# EAGLE schematic slave-board (EAGLE 8.6.0)
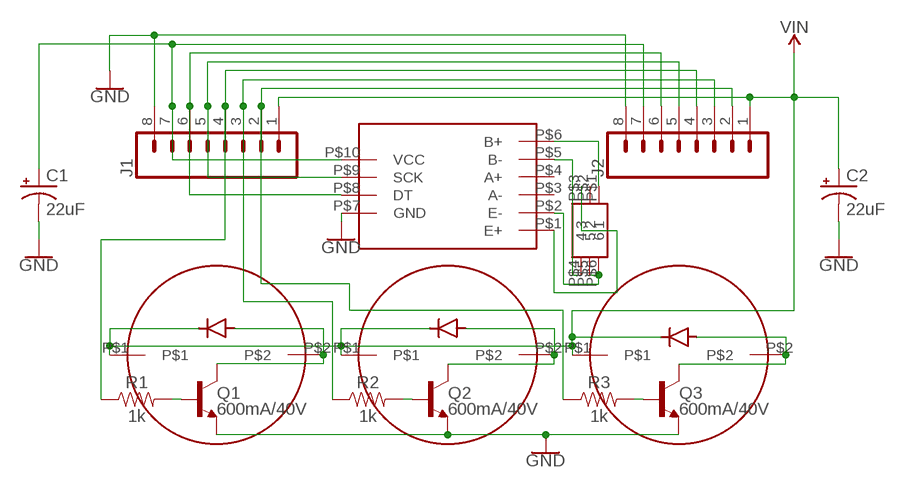
[diagram p0: schematic, sheet 1]

## Parts
C1  22uF  22UF-POLAR-PANASONIC_C-35V-20%  [PANASONIC_C]
C2  22uF  22UF-POLAR-PANASONIC_C-35V-20%  [PANASONIC_C]
J1  CONN_08"  [1X08]
J2  CONN_08"  [1X08]
Q1  600mA/40V  TRANS_NPN-MMBT2222AL  [SOT23-3]
Q2  600mA/40V  TRANS_NPN-MMBT2222AL  [SOT23-3]
Q3  600mA/40V  TRANS_NPN-MMBT2222AL  [SOT23-3]
R1  1k  1KOHM-0603-1/10W-1%  [0603]
R2  1k  1KOHM-0603-1/10W-1%  [0603]
R3  1k  1KOHM-0603-1/10W-1%  [0603]
U$1  HX711  [HX711]
U$2  CJV23-SOLENOID-VALVE  [CJV23]
U$3  CJV23-SOLENOID-VALVE  [CJV23]
U$4  CJV23-SOLENOID-VALVE  [CJV23]
U$5  IN4148  [IN4148]
U$6  IN4148  [IN4148]
U$7  IN4148  [IN4148]
U$8  2SMPP-03  [2SMPP-03]

## Nets
GND: C1.- C2.- J1.8 J2.8 Q1.2(E) Q2.2(E) Q3.2(E) U$1.P$7(GND)
N$1: Q1.1(B) R1.2
N$2: Q2.1(B) R2.2
N$3: Q3.1(B) R3.2
N$4: U$1.P$6(B+) U$8.P$1
N$5: J1.2 J2.2 R3.1
N$6: U$1.P$5(B-) U$8.P$4
N$7: Q3.3(C) U$4.P$2 U$7.P$2
N$8: Q2.3(C) U$3.P$2 U$6.P$2
N$9: Q1.3(C) U$2.P$2 U$5.P$2
N$10: J1.3 J2.3 R2.1
N$11: U$1.P$2(E-) U$8.P$5 U$8.P$6
N$12: J1.4 J2.4 R1.1
N$13: J1.5 J2.5 U$1.P$9(SCK)
N$14: J1.6 J2.6 U$1.P$8(DT)
N$15: C1.+ J1.7 J2.7 U$1.P$10(VCC)
N$16: U$1.P$1(E+) U$8.P$3
VIN: C2.+ J1.1 J2.1 U$2.P$1 U$3.P$1 U$4.P$1 U$5.P$1 U$6.P$1 U$7.P$1
Unconnected: U$1.P$3(A-) U$1.P$4(A+) U$8.P$2

## Library data of the parts
C1 C2 = SparkFun-Capacitors:22UF-POLAR: 22µF polarized capacitors A capacitor is a passive two-terminal electrical component used to store electrical energy temporarily in an electric field.; PROD_ID: CAP-08618
J1 J2 = SparkFun-Connectors:CONN_08: Multi connection point. Often used as Generic Header-pin footprint for 0.1 inch spaced/style header connections On any of the 0.1 inch spaced packages, you can populate with these: Break Away Headers - Straight <https://www.sparkfun.com/products/116> (PRT-00116) Break Away Male Headers - Right Angle <https://www.sparkfun.com/products/553> (PRT-00553) Female Headers <https://www.sparkfun.com/products/115> (PRT-00115) Break Away Headers - Machine Pin <https://www.sparkfun.com/products/117> (PRT-00117) Break Away Female Headers - Swiss Machine Pin <https://www.sparkfun.com/products/743> (PRT-00743) Arduino Stackable Header - 8 Pin <https://www.sparkfun.com/products/9279> (PRT-09279) For SCREWTERMINALS and SPRING TERMINALS visit here: Screw Terimnals on SparkFun.com <https://www.sparkfun.com/search/results?term=Screw+Terminals> (5mm/3.5mm/2.54mm spacing) This device is also useful as a general connection point to wire up your design to another part of your project. Our various solder wires solder well into these plated through hole pads. Hook-Up Wire - Assortment (Stranded, 22 AWG) <https://www.sparkfun.com/products/11375> (PRT-11375) Hook-Up Wire - Assortment (Solid Core, 22 AWG) <https://www.sparkfun.com/products/11367> (PRT-11367) View the entire wire category on our website here <https://www.sparkfun.com/categories/141> Special notes: Molex polarized connector foot print use with SKU : PRT-08231 with associated crimp pins and housings. 1MM SMD Version SKU: PRT-10208 NOTES ON THE VARIANTS LOCK and LOCK_LONGPADS... This footprint was designed to help hold the alignment of a through-hole component (i.e. 6-pin header) while soldering it into place. You may notice that each hole has been shifted either up or down by 0.005 of an inch from it's more standard position (which is a perfectly straight line). This slight alteration caused the pins (the squares in the middle) to touch the edges of the holes. Because they are alternating, it causes a "brace" to hold the component in place. 0.005 has proven to be the perfect amount of "off-center" position when using our standard breakaway headers. Although looks a little odd when you look at the bare footprint, once you have a header in there, the alteration is very hard to notice. Also,if you push a header all the way into place, it is covered up entirely on the bottom side.; PROD_ID: CONN-08438
Q1-Q3 = SparkFun-DiscreteSemi:TRANS_NPN: NPN transistor Current controlled devices typically used to amplify current or used as a switch. BC547 - COM-08928 <http://www.sparkfun.com/products/8928> (TO-92 45V 100mA) (1.Collector 2.Base 3.Emitter) 2N3904 - COM-00521 <http://www.sparkfun.com/products/521> (TO-92 40V 200mA) (1.Emitter 2.Base 3.Collector) P2N2222A - COM-12852 <http://www.sparkfun.com/products/12852> (TO-92 40V 600mA) (1.Collector 2.Base 3.Emitter); PROD_ID: TRANS-08049
R1-R3 = SparkFun-Resistors:1KOHM: 1kΩ resistor A resistor is a passive two-terminal electrical component that implements electrical resistance as a circuit element. Resistors act to reduce current flow, and, at the same time, act to lower voltage levels within circuits. - Wikipedia; PROD_ID: RES-07856
U$1 = programmable-air-components:HX711
U$2-U$4 = programmable-air-components:CJV23-SOLENOID-VALVE: CJV23 solenoid valve
U$5-U$7 = programmable-air-components:IN4148
U$8 = programmable-air-components:2SMPP-03